# EAGLE design electronicDie (EAGLE 9.6.2)
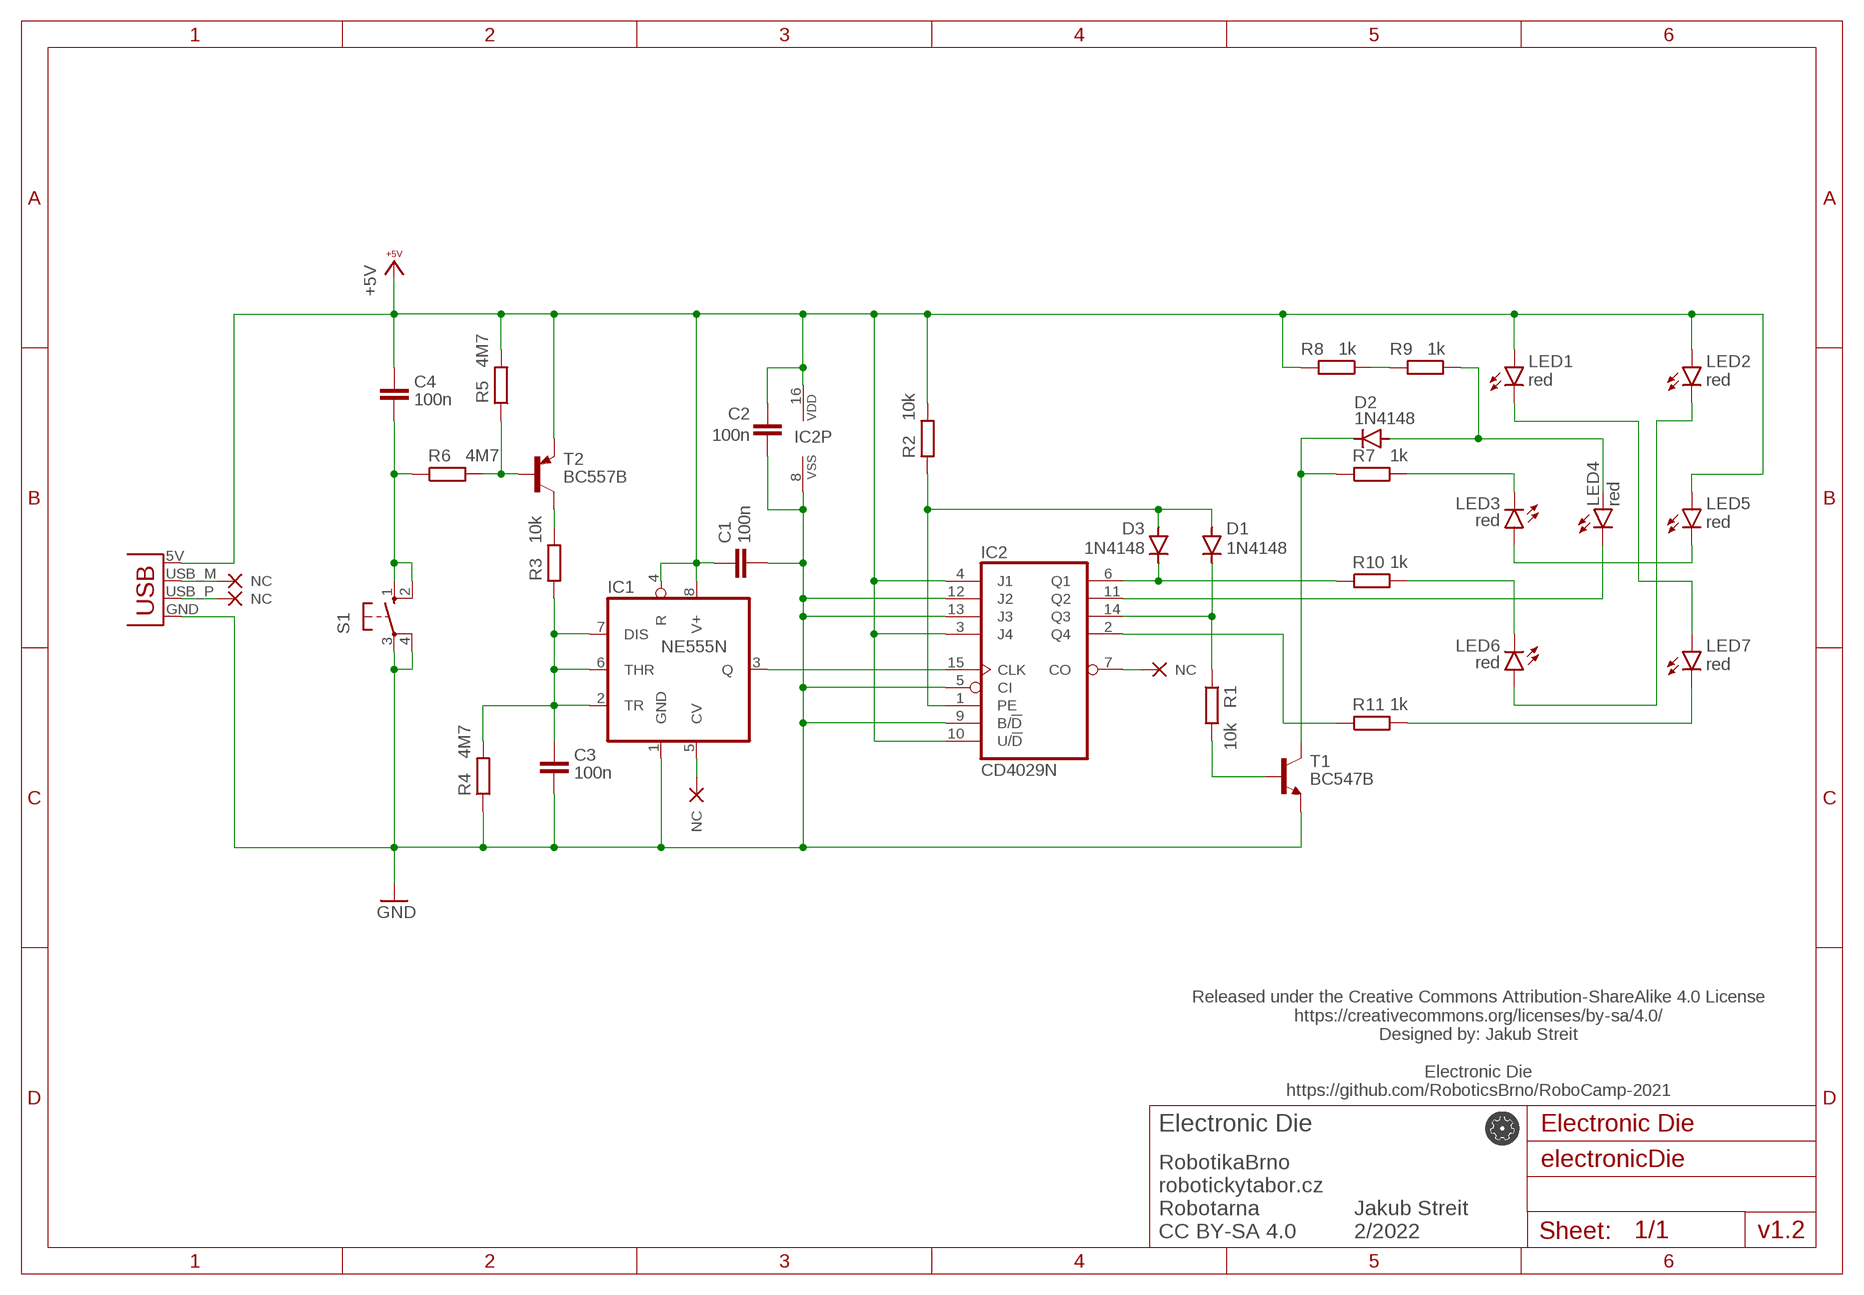
[diagram p0: schematic, sheet 1]

## Parts
C1  100n  C-EU050-024X044  [C050-024X044]
C2  100n  C-EU050-024X044  [C050-024X044]
C3  100n  C-EU050-024X044  [C050-024X044]
C4  100n  C-EU050-024X044  [C050-024X044]
D1  1N4148  1N4148DO35-10  [DO35-10]
D2  1N4148  1N4148DO35-10  [DO35-10]
D3  1N4148  1N4148DO35-10  [DO35-10]
IC1  NE555N  [DIL08]
IC2  CD4029N  4029N  [DIL16]
LED1  red  LED5MM  [LED5MM]
LED2  red  LED5MM  [LED5MM]
LED3  red  LED5MM  [LED5MM]
LED4  red  LED5MM  [LED5MM]
LED5  red  LED5MM  [LED5MM]
LED6  red  LED5MM  [LED5MM]
LED7  red  LED5MM  [LED5MM]
NC1  NC  (no package)
NC2  NC  (no package)
NC3  NC  (no package)
NC4  NC  (no package)
R1  10k  R-EU_0207/12  [0207/12]
R2  10k  R-EU_0207/12  [0207/12]
R3  10k  R-EU_0207/12  [0207/12]
R4  4M7  R-EU_0207/12  [0207/12]
R5  4M7  R-EU_0207/12  [0207/12]
R6  4M7  R-EU_0207/12  [0207/12]
R7  1k  R-EU_0207/12  [0207/12]
R8  1k  R-EU_0207/12  [0207/12]
R9  1k  R-EU_0207/12  [0207/12]
R10  1k  R-EU_0207/12  [0207/12]
R11  1k  R-EU_0207/12  [0207/12]
S1  10-XX  [B3F-10XX]
T1  BC547B  BC337-16-NPN-TO92-CBE  [TO92-CBE]
T2  BC557B  2N4126-PNP-TO92-CBE  [TO92-CBE]
X1  USBPCB  [USB-A-PCB]

## Nets
+5V: C1.1 C2.1 C4.1 IC1.4(R) IC1.8(V+) IC2.3(J4) IC2.4(J1) IC2.10(U/!D) IC2.16(VDD) LED1.A LED2.A LED5.A R2.2 R5.2 R8.2 T2.E X1.5V(VBUS)
GND: C1.2 C2.2 C3.2 IC1.1(GND) IC2.5(CI) IC2.8(VSS) IC2.9(B/!D) IC2.12(J2) IC2.13(J3) R4.1 S1.3(P) S1.4(P1) T1.E X1.GND
N$1: C4.2 R6.1 S1.1(S) S1.2(S1)
N$2: R5.1 R6.2 T2.B
N$3: R8.1 R9.2
N$4: R3.2 T2.C
N$5: C3.1 IC1.2(TR) IC1.6(THR) IC1.7(DIS) R3.1 R4.2
N$6: IC1.5(CV) NC1.NC
N$7: IC1.3(Q) IC2.15(CLK)
N$8: LED6.K(C) R10.2
N$9: D1.A D3.A IC2.1(PE) R2.1
N$10: D3.C IC2.6(Q1) R10.1
N$11: D1.C IC2.14(Q3) R1.1
N$12: IC2.2(Q4) R11.1
N$13: LED3.A LED5.K(C)
N$14: LED2.K(C) LED6.A
N$15: IC2.7(CO) NC2.NC
N$16: LED1.K(C) LED7.A
N$17: R1.2 T1.B
N$18: LED3.K(C) R7.2
N$19: D2.A LED4.A R9.1
N$20: IC2.11(Q2) LED4.K(C)
N$21: D2.C R7.1 T1.C
N$22: LED7.K(C) R11.2
N$23: NC3.NC X1.USB_M(D-)
N$24: NC4.NC X1.USB_P(D+)

## Notes on the sheet
- Released under the Creative Commons Attribution-ShareAlike 4.0 License
  https://creativecommons.org/licenses/by-sa/4.0/
  Designed by: Jakub Streit
  
  Electronic Die
  https://github.com/RoboticsBrno/RoboCamp-2021
- Electronic Die
- RobotikaBrno
  robotickytabor.cz
  Robotarna
  CC BY-SA 4.0
- Jakub Streit
  2/2022
- v1.2

## Library data of the parts
C1-C4 = rcl_upravena:C-EU: CAPACITOR, European symbol
D1-D3 = diode:1N4148: DIODE high speed (Philips)
IC1 = 555:*555: TIMER
IC2 = 40xx:4029: Binary/decimal up/down COUNTER
LED1-LED7 = led:LED: LED
NC1-NC4 = NC:NC: _EXTERNAL_
R1-R11 = rcl_upravena:R-EU_: RESISTOR, European symbol
S1 = switch-omron:10-XX: OMRON SWITCH; MPN: B3F-1000; OC_FARNELL: 176432; OC_NEWARK: 36M3542
T1 = transistor:*-NPN-: NPN Transistror BF959 corrected 2008.03.06
T2 = transistor:*-PNP-: PNP Transistror
X1 = USB:USB: USB Connectors USB-B-PTH is fully proven SKU : PRT-00139 USB-miniB is fully proven SKU : PRT-00587 USB-A-PCB is untested. USB-A-H is throughly reviewed, but untested. Spark Fun Electronics SKU : PRT-00437 USB-B-SMT is throughly reviewed, but untested. Needs silkscreen touching up. USB-A-S has not been used/tested USB-MB-H has not been used/tested

## Board
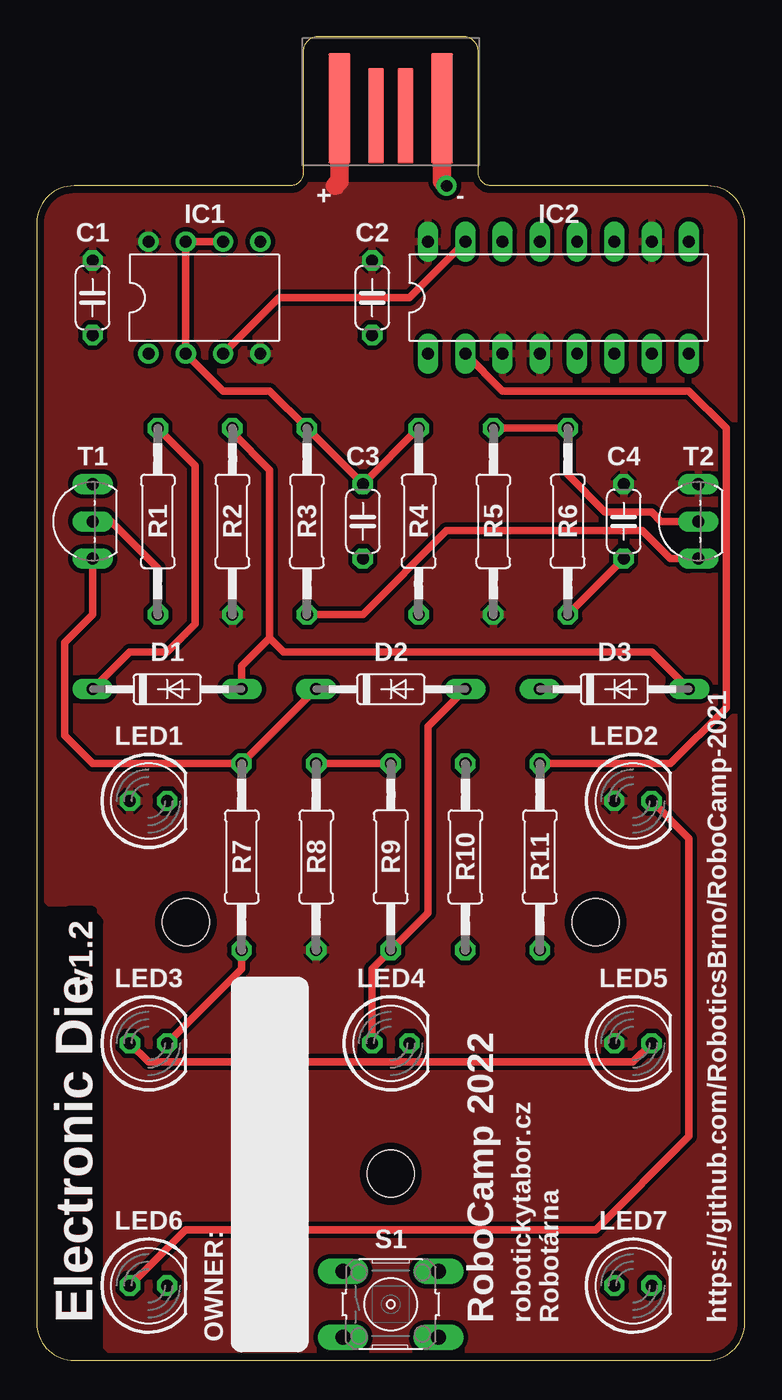
[diagram p1: board, top side]
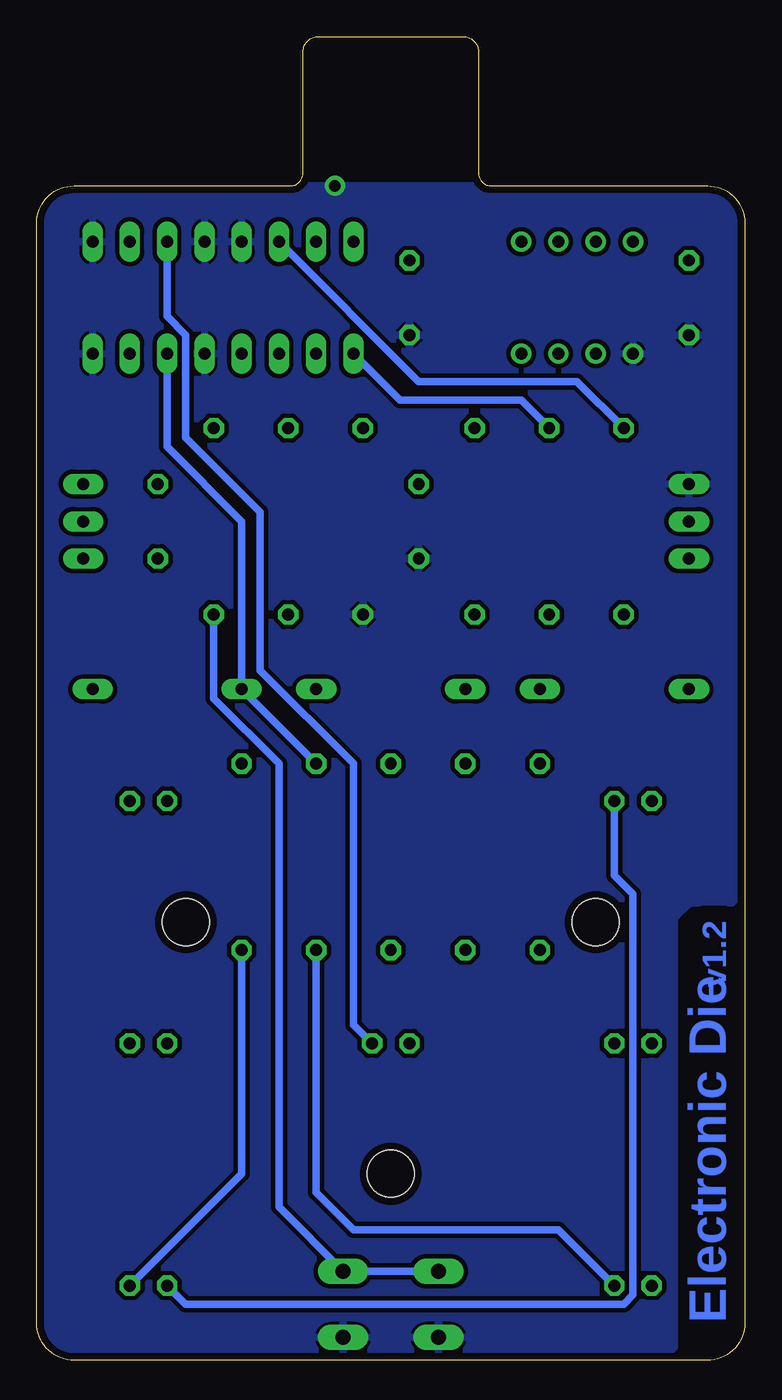
[diagram p2: board, bottom side, seen from below]

Size 48.26 x 90.17 mm. Coordinates in mm from the lower left corner, seen from the top.
Outline: 0,2.54 arc90 2.54,0 45.72,0 arc90 48.26,2.54 48.26,77.47 arc90 45.72,80.01 30.99,80.01 arc-90 30.1,80.9 30.1,89.15 arc90 29.08,90.17 19.18,90.17 arc90 18.16,89.15 18.16,80.9 arc-90 17.27,80.01 2.54,80.01 arc90 0,77.47 0,2.54
Copper layers (1*16): Top 0.035mm / dielectric 2mm / Bottom 0.035mm
Design rules "roboticsbrno": minimum track width 0.15mm, minimum drill 0.3mm, track to track 0.15mm, track to pad 0.15mm, pad to pad 0.15mm, via to via 0.15mm, smd to smd 0.15mm, copper to edge 0.5mm, drill to drill 0.5mm, minimum pad ring 0.16mm, minimum via ring 0.16mm, stop-mask expansion 0.1mm, vias tented up to drill 0.4mm, thermal gap 0.2mm
Holes 3.2 mm at 10.16,29.84 38.1,29.84 24.13,12.7
tRestrict: 5 lines
bRestrict: 5 lines

### Footprints (pad centres in the part's own frame; a part is rotated, then mirrored left to right if it is on the bottom)
C050-024X044 = drill 0.813 octagon: 1 -2.54,0; 2 2.54,0
DO35-10 = drill 0.813 long: A 5.08,0; C -5.08,0
DIL08 = drill 0.813 pad 1.27: 1 -3.81,-3.81; 2 -1.27,-3.81; 3 1.27,-3.81; 4 3.81,-3.81; 5 3.81,3.81; 6 1.27,3.81; 7 -1.27,3.81; 8 -3.81,3.81
DIL16 = drill 0.813 long: 1 -8.89,-3.81; 2 -6.35,-3.81; 3 -3.81,-3.81; 4 -1.27,-3.81; 5 1.27,-3.81; 6 3.81,-3.81; 7 6.35,-3.81; 8 8.89,-3.81; 9 8.89,3.81; 10 6.35,3.81; 11 3.81,3.81; 12 1.27,3.81; 13 -1.27,3.81; 14 -3.81,3.81; 15 -6.35,3.81; 16 -8.89,3.81
LED5MM = drill 0.813 octagon: A -1.27,0; K 1.27,0
0207/12 = drill 0.813 octagon: 1 -6.35,0; 2 6.35,0
B3F-10XX = drill 1.016 long: 1 -3.251,2.261; 2 3.251,2.261; 3 -3.251,-2.261; 4 3.251,-2.261
TO92-CBE = drill 0.813 long: B 0,0; C -2.54,0; E 2.54,0
USB-A-PCB = smd 7.5 x 1.5: 5V -0.2,-3.5; GND -0.2,3.5 | smd 6.5 x 1.067: USB_M 0.3,-1; USB_P 0.3,1

### Placement (x,y rotation side)
C1  3.81,72.39 270 top
C2  22.86,72.39 270 top
C3  22.23,57.15 270 top
C4  40.01,57.15 270 top
D1  8.89,45.72 0 top
D2  24.13,45.72 0 top
D3  39.37,45.72 0 top
IC1  11.43,72.39 0 top
IC2  35.56,72.39 0 top
LED1  7.62,38.1 0 top
LED2  40.64,38.1 0 top
LED3  7.62,21.59 0 top
LED4  24.13,21.59 0 top
LED5  40.64,21.59 0 top
LED6  7.62,5.08 0 top
LED7  40.64,5.08 0 top
R1  8.26,57.15 270 top
R2  13.34,57.15 270 top
R3  18.41,57.15 270 top
R4  26.04,57.15 90 top
R5  31.11,57.15 270 top
R6  36.2,57.15 90 top
R7  13.97,34.29 270 top
R8  19.05,34.29 270 top
R9  24.13,34.29 90 top
R10  29.21,34.29 270 top
R11  34.29,34.29 270 top
S1  24.13,3.81 0 top
T1  3.81,57.15 90 top
T2  45.09,57.15 90 top
X1  24.13,85.09 270 top

### Tracks (layer width: path | path; a pad name or v marks a point on that pad's centre or on a via)
+5V
  Top 0.508: 20.63,80.32 20.63,79.7
  Top 1.27: X1.5V 20.63,80.32 20.32,80.01
  pour Top (isolate 0.305): 0,0 0,80.01 48.26,80.01 48.26,0
GND  (via drill 0.8)
  Top 1.27: X1.GND 27.63,80.32 v27.94,80.01
  pour Bottom (isolate 0.305): 0,0 0,80.01 48.26,80.01 48.26,0
N$1
  Top 0.5: C4.2 R6.1
  Bottom 0.5: R6.1 36.2,45.09 31.75,40.64 31.75,10.44 S1.2 S1.1
N$2
  Top 0.5: R5.1 R6.2 36.2,60.33 38.73,57.78 41.91,57.78 42.55,57.15 T2.B
N$3
  Top 0.5: R8.1 R9.2
N$4
  Top 0.5: T2.C 43.18,54.61 41.27,56.52 27.94,56.52 22.23,50.8 R3.2
N$5
  Top 0.5: IC1.6 IC1.7 IC1.2 12.7,66.04 15.88,66.04 R3.1 C3.1 R4.2
N$7
  Top 0.5: IC2.15 25.4,72.39 16.51,72.39 IC1.3
N$8
  Bottom 0.5: R10.2 29.21,11.43 26.67,8.89 12.7,8.89 LED6.K
N$9
  Top 0.5: R2.1 13.34,63.18 15.88,60.64 15.88,49.21 | 15.88,49.21 14.61,47.94 13.97,47.31 D1.A | D3.A 41.91,48.26 16.83,48.26 15.88,49.21
  Bottom 0.5: IC2.1 23.5,65.41 15.24,65.41 R2.1
N$10
  Bottom 0.5: IC2.6 39.37,62.23 34.29,57.15 D3.C R10.1
N$11
  Top 0.5: D1.C 6.35,48.26 8.89,48.26 10.79,50.16 10.79,60.96 R1.1
  Bottom 0.5: IC2.14 22.23,66.67 11.43,66.67 R1.1
N$12
  Top 0.5: R11.1 43.18,40.64 46.99,44.45 46.99,63.5 44.45,66.04 31.75,66.04 IC2.2
N$13
  Top 0.5: LED3.A 7.62,20.32 40.64,20.32 LED5.K
N$14
  Top 0.5: LED6.A 10.16,8.89 38.1,8.89 44.45,15.24 44.45,35.56 LED2.K
N$16
  Bottom 0.5: LED1.K 8.89,33.02 7.62,31.75 7.62,4.45 8.26,3.81 20.32,3.81 38.1,3.81 LED7.A
N$17
  Top 0.5: T1.B 5.08,57.15 8.26,53.98 R1.2
N$18
  Top 0.5: R7.2 13.97,26.67 LED3.K
N$19
  Top 0.5: D2.A 26.67,43.18 26.67,30.48 R9.1 22.86,26.67 LED4.A
N$20
  Bottom 0.5: IC2.11 39.37,71.12 38.1,69.85 38.1,62.87 33.02,57.78 33.02,46.99 26.67,40.64 26.67,22.86 LED4.K
N$21
  Top 0.5: T1.C 3.81,50.8 1.91,48.9 1.91,42.55 3.81,40.64 R7.1 D2.C
N$22
  Bottom 0.5: R11.2 34.29,12.7 LED7.K

### Text on the board
Top: v1.2 | Electronic Die
Bottom: v1.2 | Electronic Die
tSilk: + | - | v1.2 | Electronic Die | RoboCamp 2022 | robotickytabor.cz / Robotárna | https://github.com/RoboticsBrno/RoboCamp-2021 | OWNER:
bSilk: + | JLCJLCJLCJLC | - | v1.2 | Electronic Die | robotickytabor.cz / Robotárna | RoboCamp 2022 | https://github.com/RoboticsBrno/RoboCamp-2021